# EasyEDA schematic A4988_to_FET_drive.json
TITLE: Sheet_1; REV: 1.0; Date: 2024-01-06; Sheet: 1/1; Drawn By: AmirB; Company: Your Company
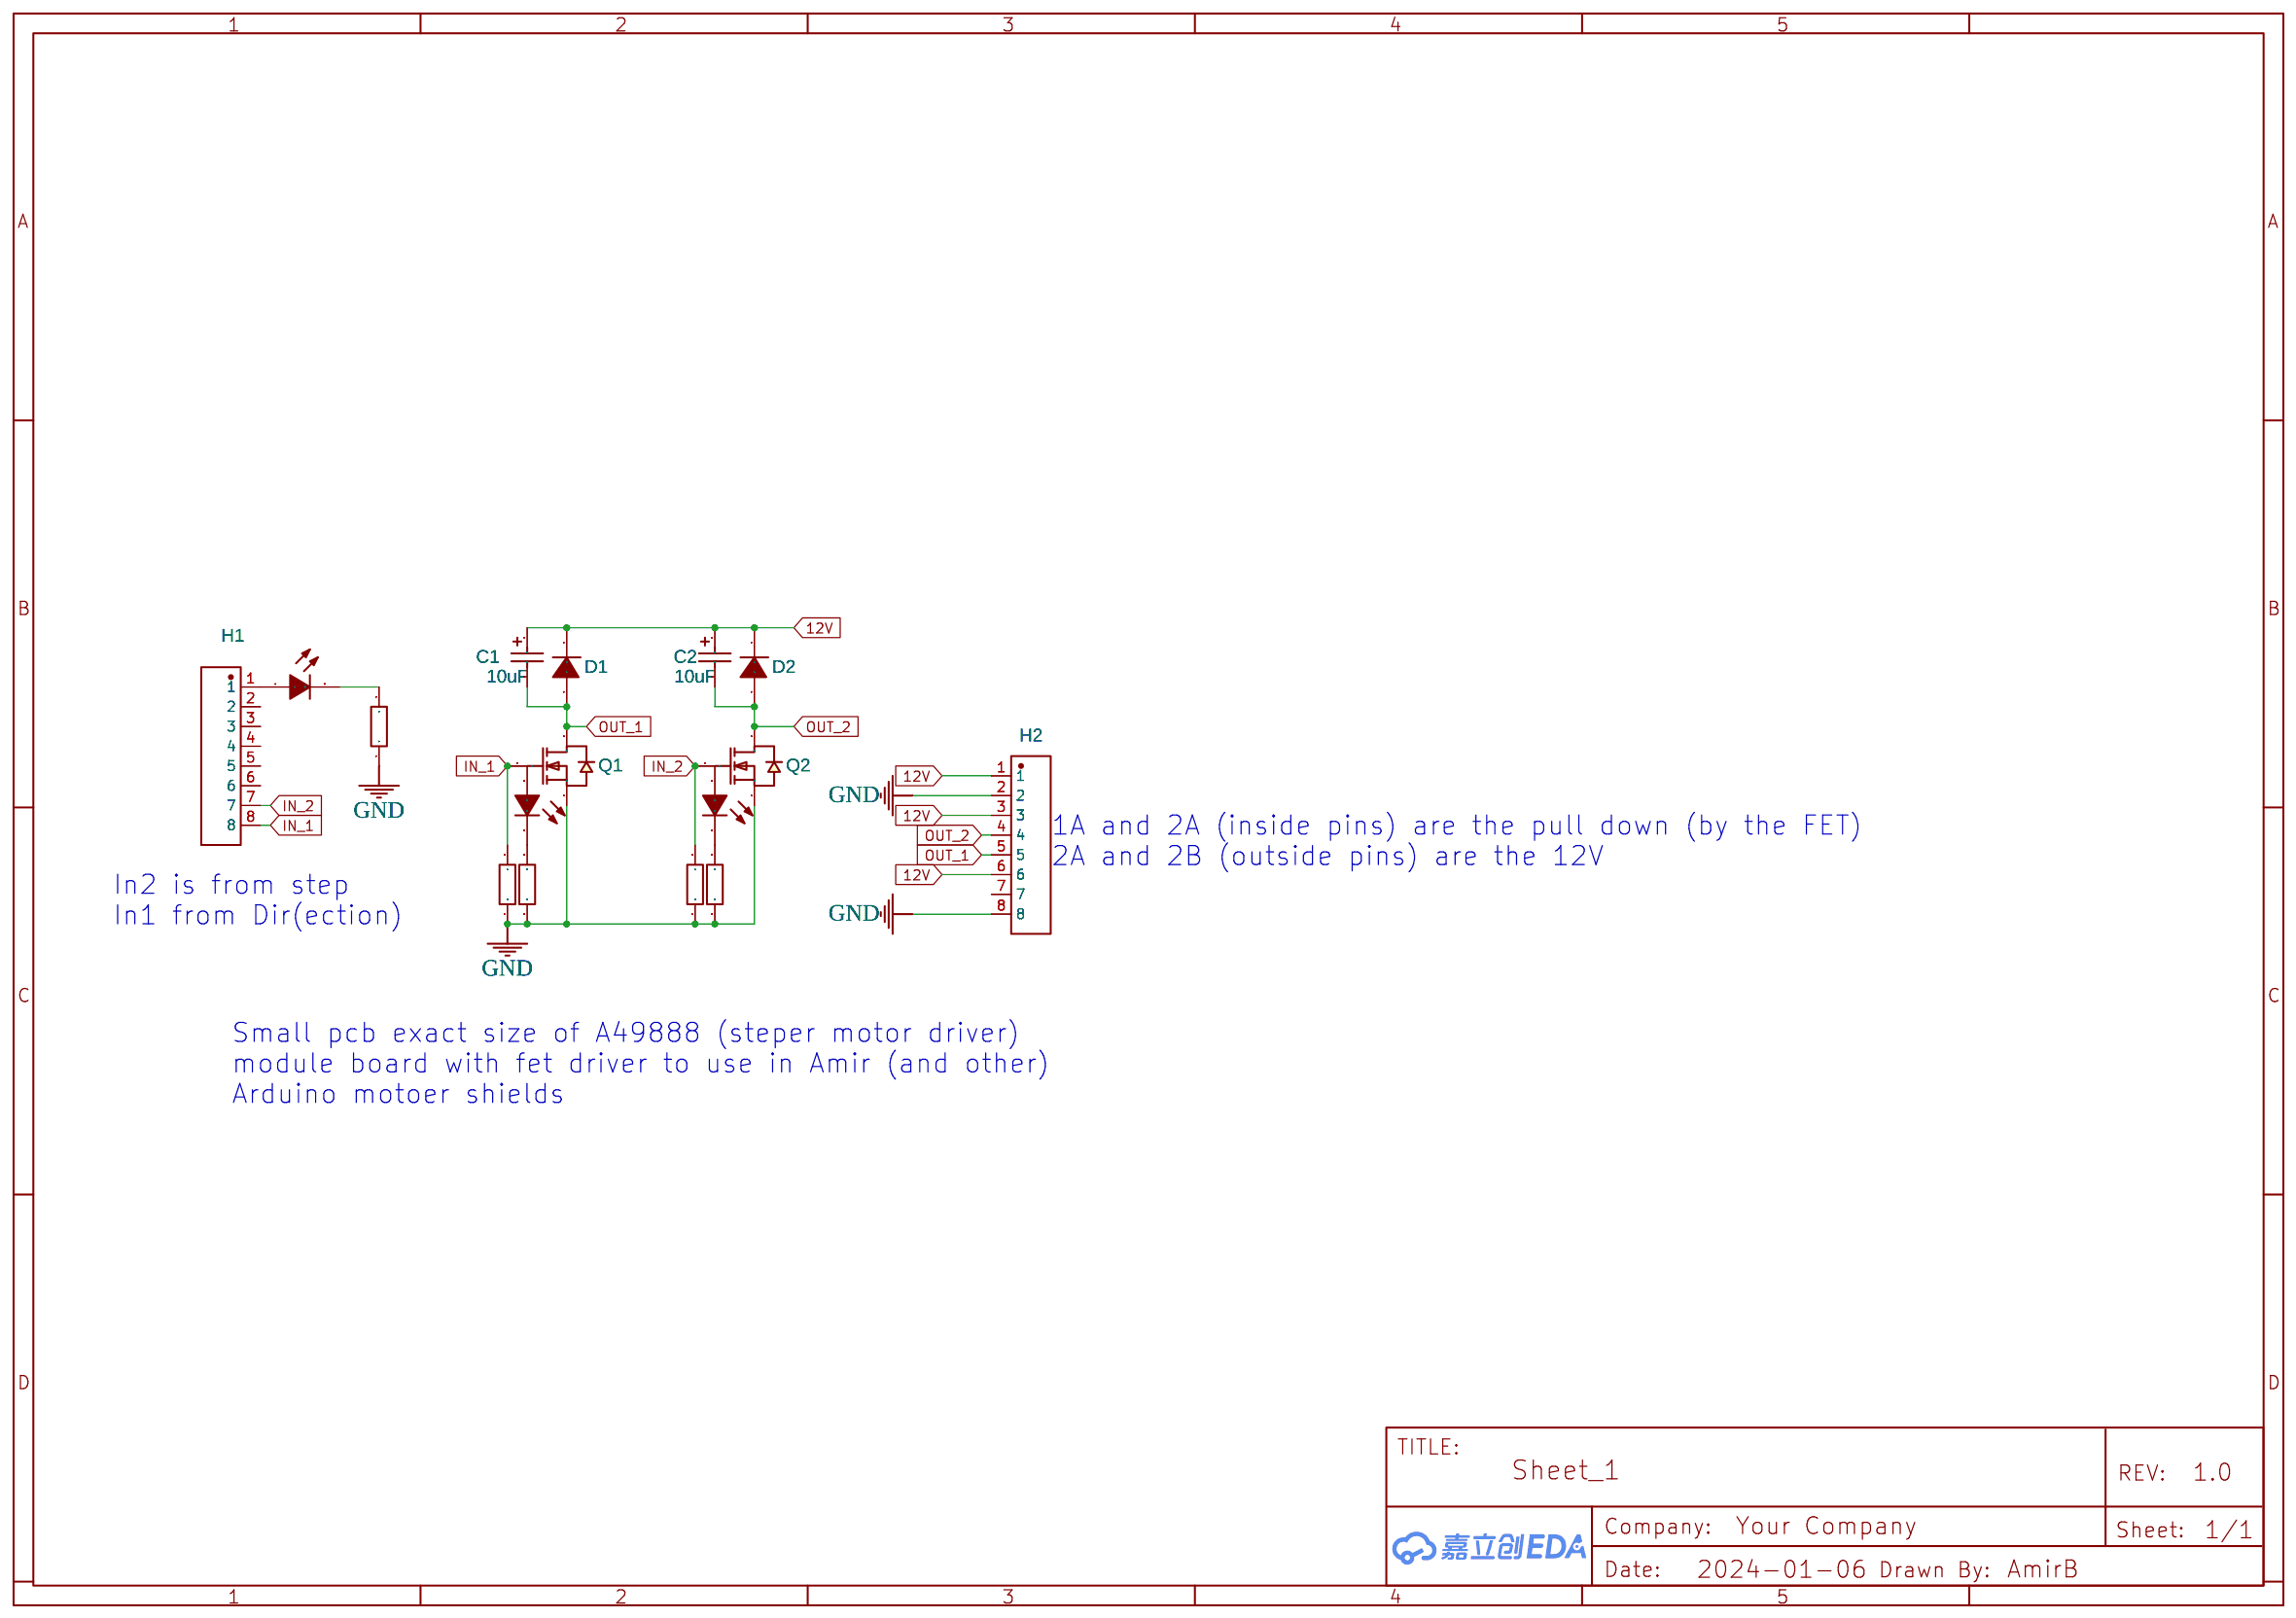
[diagram p0: schematic sheet]

## Parts
C1  10uF  [CAP-SMD_L3.2-W1.6-RD-C7171]
C2  10uF  [CAP-SMD_L3.2-W1.6-RD-C7171]
D1  M7_C95872  [SMA_L4.3-W2.6-LS5.2-RD]
D2  M7_C95872  [SMA_L4.3-W2.6-LS5.2-RD]
H1  DZ254R-11-08-63  [HDR-TH_8P-P2.54-V-M]
H2  DZ254R-11-08-63  [HDR-TH_8P-P2.54-V-M]
L1  LED  [LED0603-R-RD_BLUE]
L2  LED  [LED0603-R-RD_BLUE]
L3  LED  [LED0603-R-RD_BLUE]
PR4  R10K  [R0603]
Q1  AO3400A  [SOT-23-3_L2.9-W1.6-P1.90-LS2.8-BR]
Q2  AO3400A  [SOT-23-3_L2.9-W1.6-P1.90-LS2.8-BR]
R2  R10K  [R0603]
RL1  R10K  [R0603]
RL2  R10K  [R0603]
RL3  R10K  [R0603]

## Library data of the parts
C1 C2 = TAJA106K016RNJ: Supplier: LCSC; Manufacturer: Kyocera AVX; Supplier Part: C7171; JLCPCB Part Class: Basic Part; Package Display: No
D1 D2 = M7_C95872: Supplier: LCSC; Manufacturer: MDD; Supplier Part: C95872; JLCPCB Part Class: Basic Part; Package Display: No
H1 H2 = DZ254R-11-08-63: Contributor: LCSC; Supplier: LCSC; Supplier Part: C2935914; Manufacturer: DEALON(德艺隆); JLCPCB Part Class: Extended Part; Package Display: No
L1-L3 = 19-217/BHC-ZL1M2RY/3T: Supplier: LCSC; Manufacturer: EVERLIGHT; Supplier Part: C72041; JLCPCB Part Class: Basic Part; Package Display: No
PR4 R2 RL1-RL3 = 0603WAF1001T5E: Supplier: LCSC; Manufacturer: UniOhm; Manufacturer Part: 0603WAF1002T5E; Supplier Part: C25804; Resistance (Ohms): 10K; JLCPCB Part Class: Basic Part; Package Display: No
Q1 Q2 = AO3400A: Supplier: LCSC; Manufacturer: AOS; Supplier Part: C20917; JLCPCB Part Class: Basic Part; Package Display: No

## Nets
12V: C1.1 C2.1 D1.1(K) D2.1(K) H2.1 H2.3 H2.6
GND: H2.2 H2.8 PR4.1 Q1.2(S) Q2.2(S) R2.1 RL1.1 RL2.1 RL3.1
IN_1: H1.8 L1.1(A) PR4.2 Q1.1(G)
IN_2: H1.7 L2.1(A) Q2.1(G) R2.2
OUT_1: C1.2 D1.2(A) H2.5 Q1.3(D)
OUT_2: C2.2 D2.2(A) H2.4 Q2.3(D)
Net-(H1-1): H1.1 L3.1(A)
Net-(L1-2): L1.2(C) RL1.2
Net-(L2-2): L2.2(C) RL2.2
Net-(L3-2): L3.2(C) RL3.2

Not connected (* = marked no-connect by the designer): H1 2 3 4 5 6; H2 7

## Notes on the sheet
- 1A and 2A (inside pins) are the pull down (by the FET)
  2A and 2B (outside pins) are the 12V
- In2 is from step
  In1 from Dir(ection)
- Small pcb exact size of A49888 (steper motor driver)
  module board with fet driver to use in Amir (and other)
  Arduino motoer shields
